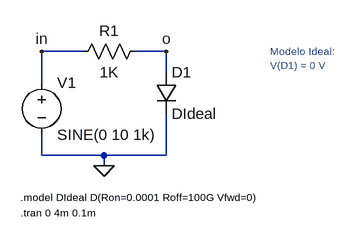
[diagram p0: schematic ac-ejemplo1_ideal.asc]
ac-ejemplo1_ideal.asc, the LTspice schematic file:
Version 4
SHEET 1 1376 680
WIRE 80 48 16 48
WIRE 208 48 160 48
WIRE 208 80 208 48
WIRE 16 96 16 48
WIRE 16 208 16 176
WIRE 112 208 16 208
WIRE 208 208 208 144
WIRE 208 208 112 208
WIRE 112 224 112 208
FLAG 112 224 0
FLAG 208 48 o
FLAG 16 48 in
SYMBOL diode 192 80 R0
SYMATTR InstName D1
SYMATTR Value DIdeal
SYMBOL voltage 16 80 R0
WINDOW 123 0 0 Left 0
WINDOW 39 0 0 Left 0
SYMATTR InstName V1
SYMATTR Value SINE(0 10 1k)
SYMBOL res 64 64 R270
WINDOW 0 32 56 VTop 2
WINDOW 3 0 56 VBottom 2
SYMATTR InstName R1
SYMATTR Value 1K
TEXT -16 296 Left 1 !.tran 0 4m 0.1m
TEXT -16 272 Left 1 !.model DIdeal D(Ron=0.0001 Roff=100G Vfwd=0)
TEXT 368 48 Left 1 ;Modelo Ideal:\nV(D1) = 0 V

The netlist it stands for:
* ac-ejemplo1_ideal.asc
D1 o 0 DIdeal
V1 in 0 SINE(0 10 1k)
R1 in o 1K
.model D D
.lib standard.dio
.tran 0 4m 0.1m
.model DIdeal D(Ron=0.0001 Roff=100G Vfwd=0)
* Modelo Ideal:
* V(D1) = 0 V
.backanno
.end